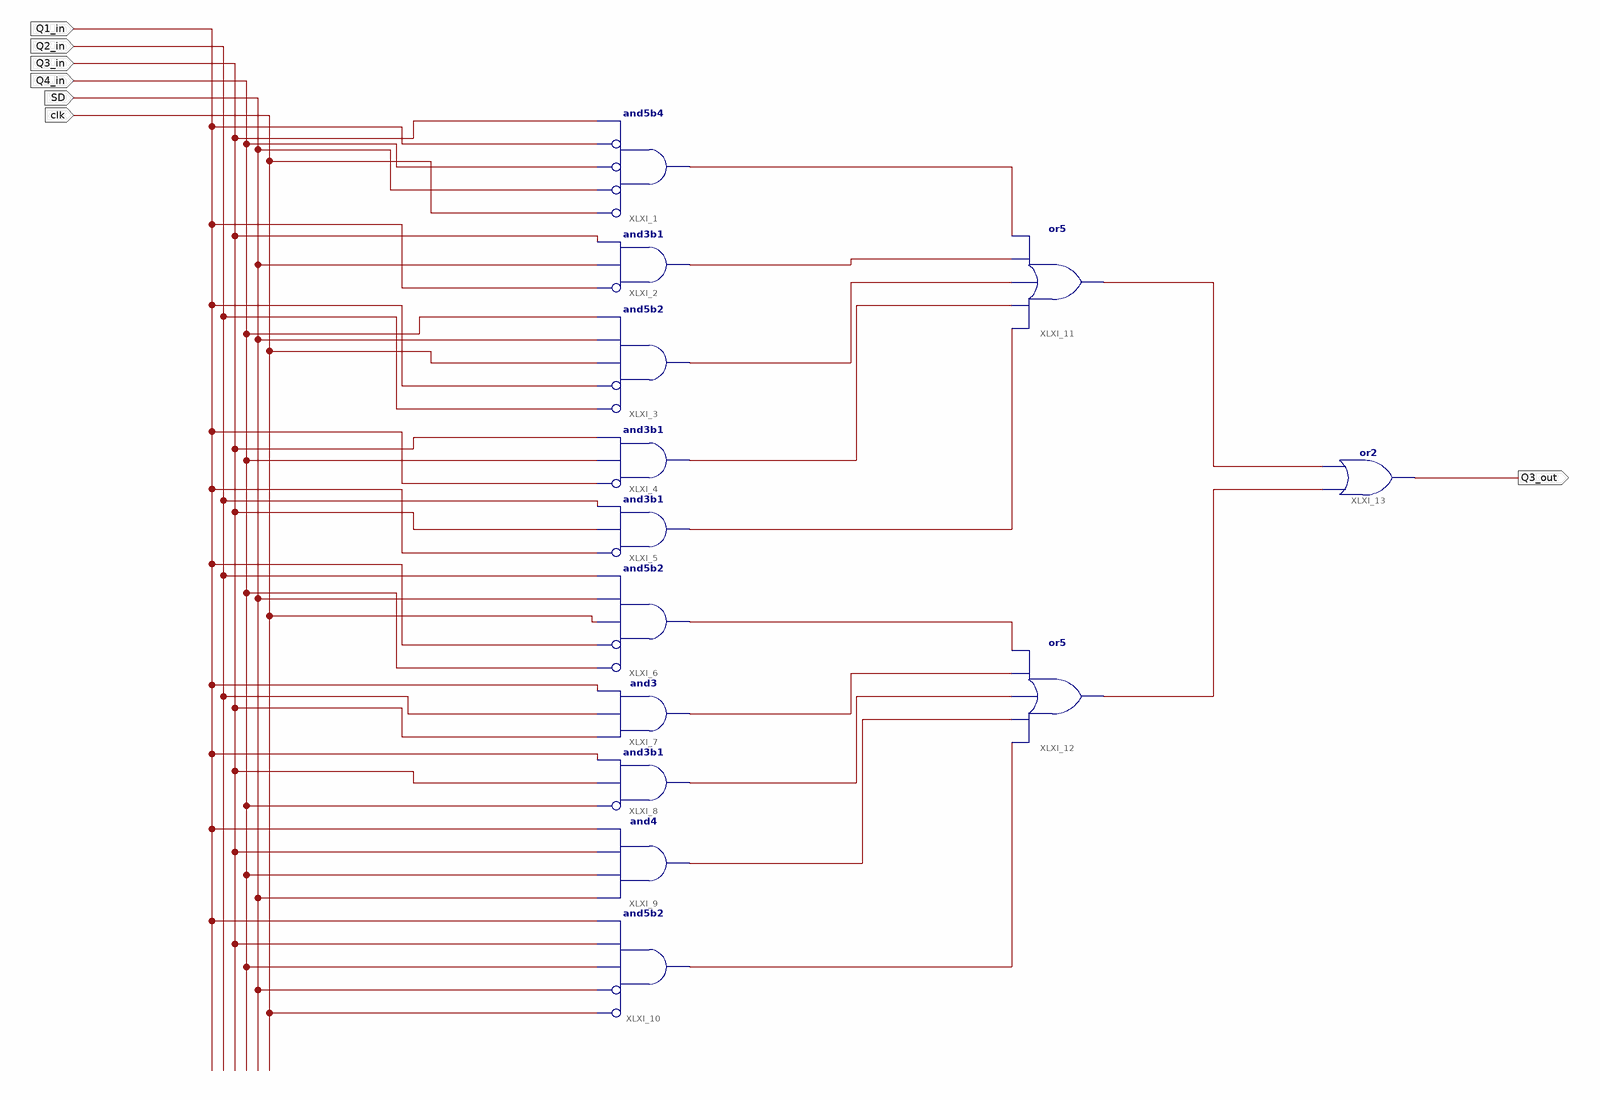
[diagram p0: schematic sheet 1]
// Xilinx ISE schematic Q3_schematic.sch (spartan6) as structural Verilog: 13 symbols, 7 ports
module Q3_schematic (
  input  Q1_in,
  input  Q2_in,
  input  Q3_in,
  input  Q4_in,
  input  SD,
  input  clk,
  output Q3_out
);

  wire XLXN_12, XLXN_13, XLXN_14, XLXN_15, XLXN_16, XLXN_17, XLXN_18, XLXN_19, XLXN_20, XLXN_21, XLXN_22,
       XLXN_23;

  and XLXI_1 (XLXN_12, ~clk, ~SD, ~Q4_in, ~Q1_in, Q3_in);  // and5b4
  and XLXI_2 (XLXN_13, ~Q1_in, SD, Q3_in);  // and3b1
  and XLXI_3 (XLXN_14, ~Q2_in, ~Q1_in, clk, SD, Q4_in);  // and5b2
  and XLXI_4 (XLXN_15, ~Q1_in, Q4_in, Q3_in);  // and3b1
  and XLXI_5 (XLXN_16, ~Q1_in, Q3_in, Q2_in);  // and3b1
  and XLXI_6 (XLXN_17, ~Q4_in, ~Q1_in, clk, SD, Q2_in);  // and5b2
  and XLXI_7 (XLXN_18, Q3_in, Q2_in, Q1_in);
  and XLXI_8 (XLXN_19, ~Q4_in, Q3_in, Q1_in);  // and3b1
  and XLXI_9 (XLXN_20, SD, Q4_in, Q3_in, Q1_in);
  and XLXI_10 (XLXN_21, ~clk, ~SD, Q4_in, Q3_in, Q1_in);  // and5b2
  or XLXI_11 (XLXN_22, XLXN_16, XLXN_15, XLXN_14, XLXN_13, XLXN_12);
  or XLXI_12 (XLXN_23, XLXN_21, XLXN_20, XLXN_19, XLXN_18, XLXN_17);
  or XLXI_13 (Q3_out, XLXN_23, XLXN_22);
endmodule
